# EasyEDA Pro project 一体板.epro, board PCB2_1
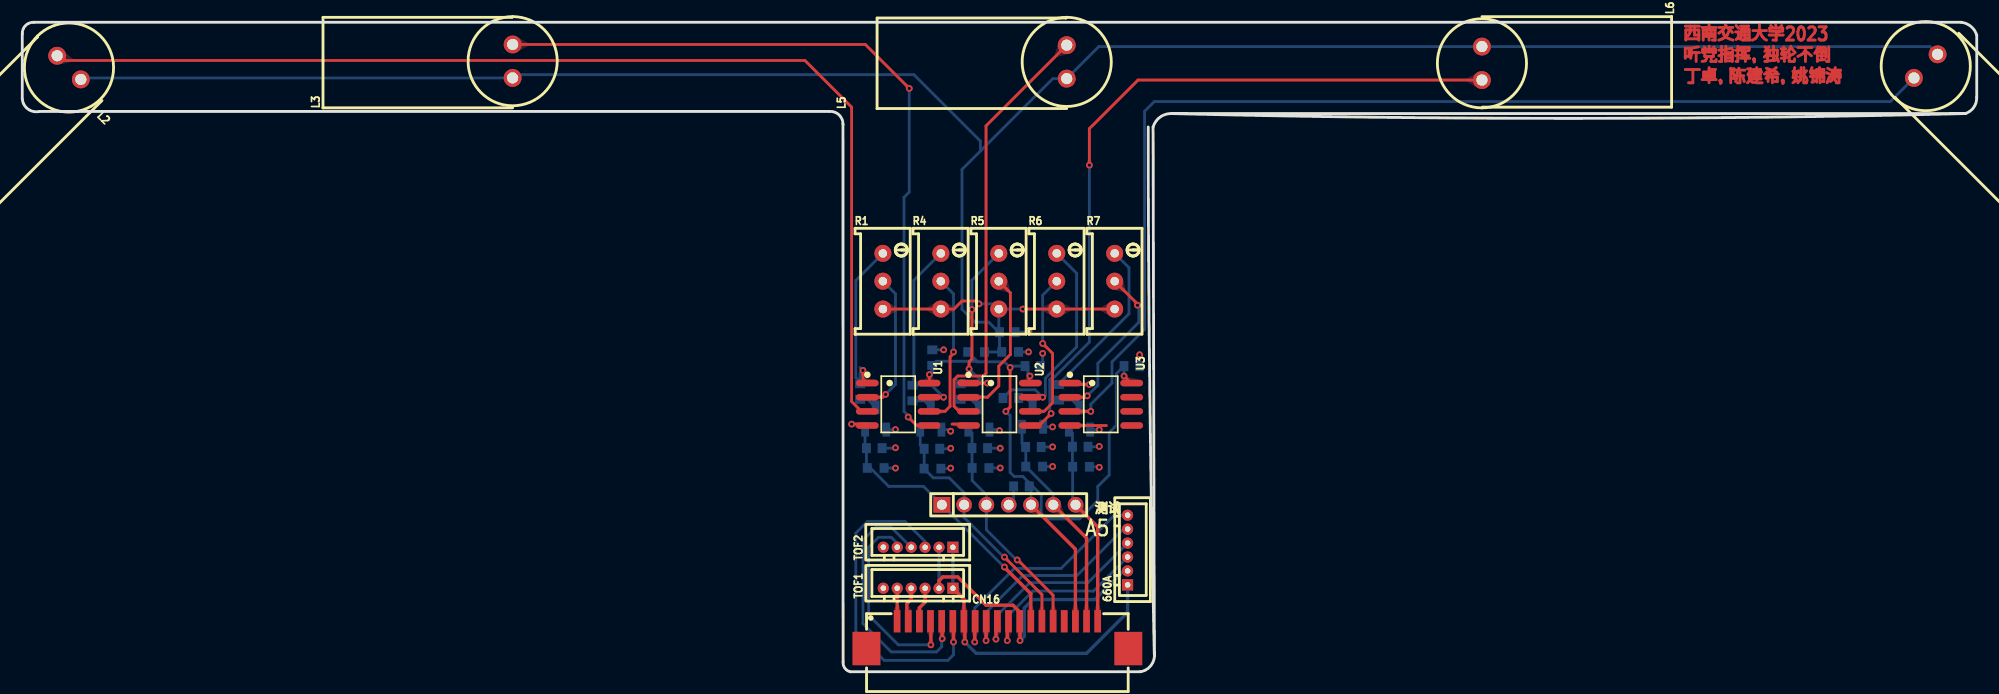
[diagram p9: board, top side]
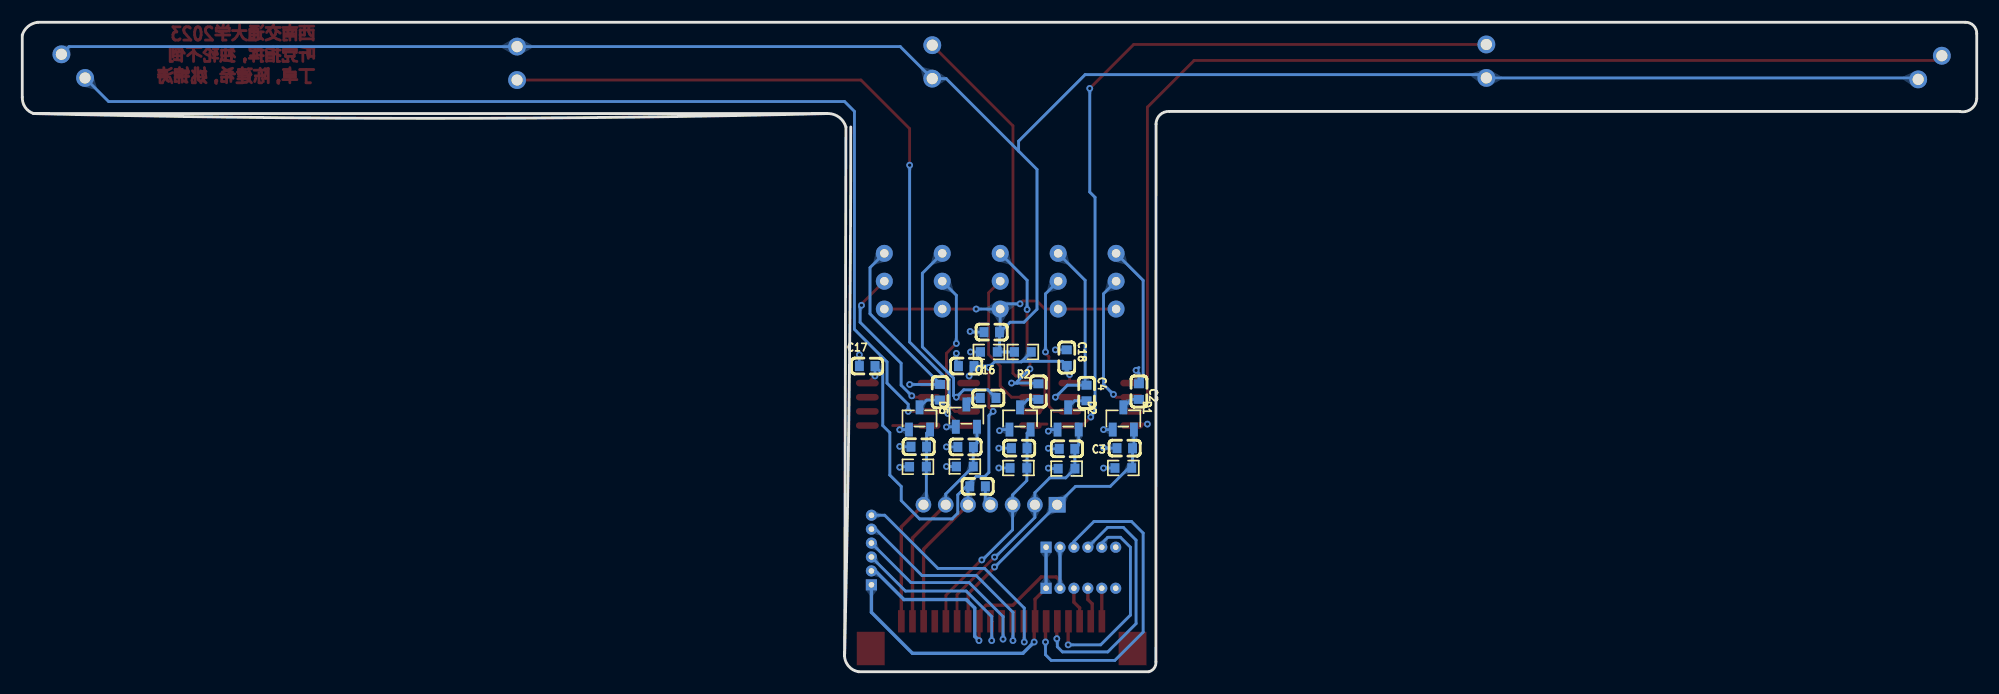
[diagram p10: board, bottom side, seen from below]

Outline 175.39 x 58.29 mm; copper layers: Top Layer, Bottom Layer. Coordinates in mm from the lower left corner of the outline.
Outline path: 101.48,48.89 101.59,1.65 arc(101.29,0.57) 100.33,0 74.3,0 arc(73.81,0.33) 73.66,0.89 73.65,49.15 arc(73.3,49.98) 72.45,50.29 1.52,50.29 arc(0.5,50.51) 0,51.44 0,57.28 arc(0.29,58) 1.02,58.29 173.99,58.29 arc(174.86,57.93) 175.39,57.15 175.39,51.56 arc(175.12,50.66) 174.37,50.1 ; 101.48,48.89 arc(102.05,49.74) 103,50.1 ; 101.48,48.89 arc(101.51,25.15) 101.6,1.4 ; 174.37,50.1 103.12,50.1 arc(138.75,50.08) 174.37,50.1
Stack: Top Layer 0.035mm / Dielectric1 1.51mm FR4 er 4.5 / Bottom Layer 0.035mm

## Design rules (mm)
template: JLCPCB Capability(Two Layers Board)
spacing copperThickness1oz (default): track to track 0.102, other pairs 0.152 to 0.3
spacing copperThickness2oz: track to track 0.203, other pairs 0.152 to 0.3
track width copperThickness1oz (default): min 0.127, default 0.254, max 2.54
track width copperThickness2oz: min 0.203, default 0.254, max 2.54
differential pair differentialPair (default): width min 0.127, default 0.254, max 2.54; gap min 0.152, default 0.152
via viaSize (default): diameter min 0.5, default 0.61, max 10; hole min 0.3, default 0.305, max 6.3

## Placement (name value [footprint] x y rotation side)
660A  -  [CONN-TH_6P-P1.25_HCTL_HC-1.25-6A]  99.19 10.92 90 top
C1  1uF  [C0603]  88.39 30.48 180 bottom
C2  100nF  [C0603]  75.18 25.15 270 bottom
C3  100nF  [C0603]  76.45 20.07 180 bottom
C4  100nF  [C0603]  79.88 25.02 270 bottom
C5  100nF  [C0603]  81.63 20.01 180 bottom
C6  100nF  [C0603]  84.2 25.15 270 bottom
C7  100nF  [C0603]  85.92 20.07 180 bottom
C8  100nF  [C0603]  88.71 24.57 0 bottom
C9  100nF  [C0603]  90.73 20.18 180 bottom
C10  100nF  [C0603]  93.03 25.08 270 bottom
C11  100nF  [C0603]  94.94 20.19 180 bottom
C13  1uF  [C0603]  89.66 16.64 0 bottom
C16  100nF  [C0603]  90.68 27.43 180 bottom
C17  100nF  [C0603]  99.57 27.43 180 bottom
C18  100nF  [C0603]  81.66 28.19 270 bottom
CN16  HC-1.25-6A  [CONN-TH_6P-P1.25_HCTL_HC-1.25-6A]  80.39 7.49 180 top
D1  BAT54S  [SOT-23-3_L2.9-W1.3-P1.90-LS2.4-BR]  76.58 22.73 270 bottom
D2  BAT54S  [SOT-23-3_L2.9-W1.3-P1.90-LS2.4-BR]  81.53 22.73 270 bottom
D3  BAT54S  [SOT-23-3_L2.9-W1.3-P1.90-LS2.4-BR]  85.85 22.73 270 bottom
D4  BAT54S  [SOT-23-3_L2.9-W1.3-P1.90-LS2.4-BR]  90.66 22.99 270 bottom
D5  BAT54S  [SOT-23-3_L2.9-W1.3-P1.90-LS2.4-BR]  94.87 22.73 270 bottom
H1  PZ200V-11-07P  [HDR-TH_7P-P2.00-V-M]  88.52 14.99 0 top
L2  10mH  [IND-TH_BD8.0-P3.00-D0.6]  4.19 54.23 135 top
L3  10mH  [IND-TH_BD8.0-P3.00-D0.6]  44 54.8 90 top
L5  10mH  [IND-TH_BD8.0-P3.00-D0.6]  93.73 54.74 90 top
L6  10mH  [IND-TH_BD8.0-P3.00-D0.6]  130.99 54.61 270 top
L7  10mH  [IND-TH_BD8.0-P3.00-D0.6]  170.82 54.36 225 top
R1  500kΩ  [RES-ADJ-TH_3P-L9.5-W4.85-P2.50-BL-BS]  77.23 35.05 0 top
R2  10kΩ  [R0603]  85.6 28.7 180 bottom
R3  10kΩ  [R0603]  88.65 28.7 180 bottom
R4  500kΩ  [RES-ADJ-TH_3P-L9.5-W4.85-P2.50-BL-BS]  82.43 35.05 0 top
R5  500kΩ  [RES-ADJ-TH_3P-L9.5-W4.85-P2.50-BL-BS]  87.63 35.05 0 top
R6  500kΩ  [RES-ADJ-TH_3P-L9.5-W4.85-P2.50-BL-BS]  92.83 35.05 0 top
R7  500kΩ  [RES-ADJ-TH_3P-L9.5-W4.85-P2.50-BL-BS]  98.03 35.05 0 top
R8  100kΩ  [R0603]  76.58 18.29 180 bottom
R9  100kΩ  [R0603]  81.67 18.23 180 bottom
R10  100kΩ  [R0603]  85.99 18.29 180 bottom
R11  100kΩ  [R0603]  90.81 18.41 180 bottom
R12  100kΩ  [R0603]  95.01 18.4 180 bottom
TOF1  X10B25L19T  [FPC-SMD_X10B25U19T]  87.5 3.3 0 top
TOF2  -  [CONN-TH_6P-P1.25_HCTL_HC-1.25-6A]  80.39 11.18 180 top
U1  OPA2350UA/2K5  [SOIC-8_L4.9-W3.9-P1.27-LS6.0-BL]  78.6 24 270 top
U2  OPA2350UA/2K5  [SOIC-8_L4.9-W3.9-P1.27-LS6.0-BL]  87.69 24 270 top
U3  OPA2350UA/2K5  [SOIC-8_L4.9-W3.9-P1.27-LS6.0-BL]  96.78 24 270 top

## Footprints (pads in the part's own frame, mm; a bottom-side part is the same pattern mirrored in y, then rotated)
C0603
  rect 0.8x0.9 smd: 1(-0.7,0) 2(0.7,0)
CONN-TH_6P-P1.25_HCTL_HC-1.25-6A
  rect 1x1 hole 0.5: 1(-3.125,0)
  round 1 hole 0.5: 2(-1.875,0) 3(-0.625,0) 4(0.625,0) 5(1.875,0) 6(3.125,0)
FPC-SMD_X10B25U19T
  rect 0.6x2 smd: 1(-9,1.225) 2(-8,1.225) 3(-7,1.225) 4(-6,1.225) 5(-5,1.225) 6(-4,1.225) 7(-3,1.225) 8(-2,1.225) 9(-1,1.225) 10(0,1.225) 11(1,1.225) 12(2,1.225) 13(3,1.225) 14(4,1.225) 15(5,1.225) 16(6,1.225) 17(7,1.225) 18(8,1.225) 19(9,1.225)
  rect 2.5x3 smd: 20(11.75,-1.225) 21(-11.75,-1.225)
HDR-TH_7P-P2.00-V-M
  rect 1.524x1.4 hole 0.9: 1(-6,0)
  round 1.4 hole 0.9: 2(-4,0) 3(-2,0) 4(0,0) 5(2,0) 6(4,0) 7(6,0)
IND-TH_BD8.0-P3.00-D0.6
  round 1.6 hole 1.001: 1(-1.501,0) 2(1.501,0)
R0603
  rect 0.806x0.864 smd: 1(-0.753,0) 2(0.753,0)
RES-ADJ-TH_3P-L9.5-W4.85-P2.50-BL-BS
  round 1.524 hole 0.762: 1(0,2.5) 2(0,0) 3(0,-2.5)
SOIC-8_L4.9-W3.9-P1.27-LS6.0-BL
  oval 0.588x2.045 smd: 1(-1.905,-2.772) 2(-0.635,-2.772) 3(0.635,-2.772) 4(1.905,-2.772) 5(1.905,2.772) 6(0.635,2.772) 7(-0.635,2.772) 8(-1.905,2.772)
SOT-23-3_L2.9-W1.3-P1.90-LS2.4-BR
  rect 1.25x0.7 smd: 1(1,-0.95) 2(1,0.95) 3(-1,0)

## Nets
2.5V: C1.2 L2.1 L3.1 L5.1 L6.1 L7.1 R1.3 R2.1 R3.2 R4.3 R5.3 R6.3 R7.3
3.3V_LDO: 660A.1 CN16.1 TOF1.7 TOF2.1
5V: C13.2 C16.2 C17.2 C18.2 H1.5 R2.2 TOF1.17 U1.8 U2.8 U3.8
GND: C1.1 C3.1 C5.1 C7.1 C9.1 C11.1 C13.1 C16.1 C17.1 C18.1 D1.1 D2.1 D3.1 D4.1 D5.1 H1.4 R3.1 R8.1 R9.1 R10.1 R11.1 R12.1 TOF1.16 TOF1.20 TOF1.21 U1.4 U2.4 U3.4
GND_OTHER: 660A.2 CN16.2 TOF1.12 TOF2.2
20.11: 660A.3 TOF1.11
20.12: 660A.5 TOF1.9
20.13: 660A.6 TOF1.8
20.14: 660A.4 TOF1.10
AD1: C3.2 D1.2 H1.1 R8.2 TOF1.13
AD2: C5.2 D2.2 H1.2 R9.2 TOF1.14
AD3: C7.2 D3.2 H1.3 R10.2 TOF1.15
AD4: C9.2 D4.2 H1.6 R11.2 TOF1.18
AD5: C11.2 D5.2 H1.7 R12.2 TOF1.19
DL1A_SCL: TOF1.6 TOF2.3
DL1A_SCL_2: CN16.3 TOF1.3
DL1A_SDA: TOF1.5 TOF2.4
DL1A_SDA_2: CN16.4 TOF1.2
DL1A_XSHUT: TOF1.4 TOF2.5
DL1A_XSHUT_2: CN16.5 TOF1.1
IN1+: L2.2 U1.3
IN1-: R1.2 U1.2
IN2+: L3.2 U1.5
IN2-: R4.2 U1.6
IN3+: L5.2 U2.3
IN3-: R5.2 U2.2
IN4+: L6.2 U2.5
IN4-: R6.2 U2.6
IN5+: L7.2 U3.3
IN5-: R7.2 U3.2
YFOUT1: C2.1 R1.1 U1.1
YFOUT2: C4.1 R4.1 U1.7
YFOUT3: C6.1 R5.1 U2.1
YFOUT4: C8.1 R6.1 U2.7
YFOUT5: C10.1 R7.1 U3.1
$1N1524: C2.2 D1.3
$1N1793: C4.2 D2.3
$1N1950: C6.2 D3.3
$1N2107: C8.2 D4.3
$1N2264: C10.2 D5.3

Pads without a net: CN16 6; TOF2 6; U3 5 6 7

## Via types
v1: diameter 0.61, hole 0.305, Top Layer to Bottom Layer, 57 vias

## Routing (per net, layer and track width the routed paths; a pad name or vN(x,y) marks a point on that pad's centre or on a via; arc(x,y) is an arc through that point)
2.5V: length 220.6
  Top Layer w0.254: R1.3 R4.3 83.61,32.55 84.33,33.27 85.6,33.27 v1(85.85,33.02) ; R7.3 R6.3 v1(89.79,32.55)
  Bottom Layer w0.254: R5.3 87.16,33.02 v1(85.85,33.02) ; R5.3 v1(89.79,32.55) ; R5.3 87.63,30.48 ; 87.63,30.48 C1.2 87.69,30.19 ; 87.63,30.48 86.74,31.37 85.49,31.37 84.33,32.53 84.33,45.09 85.98,46.74 ; 87.63,30.48 87.63,30.25 87.69,30.19 ; 87.69,30.19 87.69,28.9 R3.2 R2.1 ; 85.98,46.74 85.98,47.63 80.01,53.59 44.3,53.59 L3.1 5.38,53.3 L2.1 ; 85.98,46.74 92.48,53.24 L5.1 96.6,56.11 L6.1 171.18,56.11 L7.1
3.3V_LDO: length 28
  Top Layer w0.3: v1(84.58,2.67) 84.58,4.45 TOF1.7 84.5,6.51 CN16.1
  Bottom Layer w0.3: 660A.1 99.19,5.33 95.5,1.65 85.6,1.65 v1(84.58,2.67) ; TOF2.1 CN16.1
5V: length 63.5
  Top Layer w0.254: v1(90.42,26.54) 90.34,26.46 90.34,26.04 U2.8 ; v1(98.87,26.54) 99.5,25.91 U3.8 ; v1(88.27,23.37) 88.65,23.75 v1(88.65,27.31) ; U1.8 81.41,25.94 v1(81.41,26.67)
  Top Layer w0.3: TOF1.17 94.5,11 H1.5
  Bottom Layer w0.254: v1(90.42,26.54) 90.23,26.74 90.23,27.43 88.77,27.43 v1(88.65,27.31) 88.14,27.81 85.73,27.81 85.68,27.86 ; C18.2 82.03,27.86 85.68,27.86 ; H1.5 90.52,16.48 C13.2 ; C13.2 90.68,16.64 91.44,15.88 91.44,14.22 91.95,13.72 94.87,13.72 96.51,15.36 96.51,16.63 97.54,17.65 97.54,21.46 98.17,22.1 98.17,26.74 98.74,27.31 98.87,27.18 ; C13.2 90.36,16.95 89.79,17.53 89.01,17.53 88.65,17.89 88.65,22.99 v1(88.27,23.37) ; 98.87,27.18 v1(98.87,26.54) ; 98.87,27.18 C17.2 ; 85.68,27.86 R2.2
  Bottom Layer w0.381: v1(81.41,26.67) 81.66,26.92 C18.2
GND: length 27.5
  Top Layer w0.254: U2.4 84.79,22.23 83.44,22.23 ; v1(74.42,22.23) 75.7,22.23 75.83,22.1 ; U3.4 97.28,22.1
  Bottom Layer w0.254: v1(91.57,28.58) 91.57,27.5 91.63,27.43 ; v1(83.31,20.06) 83.26,20.01 C5.1 ; C7.1 v1(87.76,20.07) ; v1(96.65,18.35) 96.6,18.4 R12.1 ; v1(92.46,20.18) 92.45,20.18 C9.1 ; C3.1 78.32,20.07 v1(78.36,20.1) ; C11.1 96.62,20.19 v1(96.65,20.22) ; R9.1 83.27,18.23 v1(83.31,18.27) ; R3.1 v1(90.3,28.7) ; v1(83.31,21.59) 83.17,21.73 D2.1 ; v1(78.36,18.28) 78.35,18.29 R8.1 ; R11.1 92.45,18.42 v1(92.46,18.42) ; D5.1 96.63,21.73 v1(96.65,21.72) ; R10.1 v1(87.76,18.29) ; C18.1 82.55,28.89 ; D1.1 v1(78.36,21.73) ; v1(87.69,21.64) 87.6,21.73 D3.1 ; C1.1 90.17,30.48 ; D4.1 92.33,21.99 ; H1.4 88.96,15.43 C13.1 ; C17.1 v1(100.27,28.45)
  vias: v1(82.68,28.89) v1(90.33,30.55) v1(92.46,21.97)
GND_OTHER: length 29.4
  Top Layer w0.3: CN16.2 82.27,8.17 82.61,8.51 83.95,8.51 86.49,5.97 88.9,5.97 89.5,5.37 TOF1.12 89.54,4.5 v1(89.54,2.79)
  Bottom Layer w0.3: 660A.2 98.84,9.05 96.27,6.48 90.68,6.48 89.92,5.72 89.92,3.18 v1(89.53,2.79) ; TOF2.2 CN16.2
20.11: length 16.9
  Top Layer w0.3: v1(88.39,2.79) 88.39,4.42 TOF1.11
  Bottom Layer w0.254: 660A.3 96.13,7.24 90.68,7.24 88.39,4.95 v1(88.39,2.79)
20.12: length 20.1
  Top Layer w0.3: v1(86.49,2.79) 86.49,4.51 TOF1.9
  Bottom Layer w0.254: v1(86.49,2.79) 86.49,5.33 89.79,8.64 94.65,8.64 98.81,12.8 660A.5
20.13: length 22.1
  Top Layer w0.3: TOF1.8 85.47,4.5 v1(85.47,2.67)
  Bottom Layer w0.254: 660A.6 97.99,14.05 93.22,9.27 89.03,9.27 85.47,5.72 v1(85.47,2.67)
20.14: length 18.2
  Top Layer w0.3: TOF1.10 87.38,4.4 v1(87.38,2.92)
  Bottom Layer w0.254: v1(87.38,2.92) 87.38,4.95 90.42,8 95.64,8 660A.4
AD1: length 25.4
  Top Layer w0.3: v1(88.14,9.4) 88.14,9.37 90.5,7 TOF1.13
  Bottom Layer w0.254: v1(88.14,9.4) 88.11,9.4 H1.1 80.87,16.64 77.76,16.64 76.1,18.29 R8.2 75.75,18.36 C3.2 75.63,20.19 D1.2
AD2: length 22.6
  Top Layer w0.254: TOF1.14 91.5,6.92 v1(88.14,10.29)
  Bottom Layer w0.254: D2.2 80.58,20.36 C5.2 80.93,18.24 R9.2 81.75,17.4 83.18,17.4 84.52,16.07 H1.2 84.52,13.84 88.07,10.29 v1(88.14,10.29)
AD3: length 20.4
  Top Layer w0.254: 89.28,10.08 92.5,6.86 TOF1.15
  Bottom Layer w0.254: 84.9,21.73 85.22,21.41 C7.2 85.22,18.31 R10.2 85.24,17.15 86.52,15.88 H1.3 86.52,12.73 89.22,10.03 v1(89.28,10.03)
AD4: length 19.9
  Top Layer w0.3: TOF1.18 95.5,12 H1.6
  Bottom Layer w0.254: H1.6 92.52,15.95 R11.2 90.05,20.16 C9.2 89.71,20.5 D4.2
AD5: length 18.3
  Top Layer w0.3: H1.7 96.5,13 TOF1.19
  Bottom Layer w0.254: D5.2 94.24,21.41 C11.2 94.24,18.42 R12.2 94.26,15.25 H1.7
DL1A_SCL: length 29.8
  Top Layer w0.3: TOF1.6 83.57,4.46 v1(83.57,2.67)
  Bottom Layer w0.254: TOF2.3 81.02,11.68 79.22,13.48 75.84,13.48 74.8,12.45 74.8,3.56 77.34,1.02 83.06,1.02 83.57,1.52 v1(83.57,2.67)
DL1A_SCL_2: length 3.2
  Top Layer w0.3: CN16.3 81.02,6.24 80.5,5.73 TOF1.3
DL1A_SDA: length 23.7
  Top Layer w0.3: v1(82.55,2.96) 82.55,4.48 TOF1.5
  Bottom Layer w0.254: TOF2.4 77.99,12.95 76.58,12.95 75.44,11.81 75.44,4.32 77.98,1.78 82.04,1.78 82.5,2.24 82.5,2.92 v1(82.55,2.96)
DL1A_SDA_2: length 3.2
  Top Layer w0.3: TOF1.2 79.38,4.65 79.38,6.1 79.77,6.49 CN16.4
DL1A_XSHUT: length 18.4
  Top Layer w0.3: v1(81.53,2.41) 81.53,4.5 TOF1.4
  Bottom Layer w0.254: TOF2.5 78.52,11.53 77.98,12.07 76.83,12.07 75.95,11.18 75.95,5.08 78.61,2.41 v1(81.53,2.41)
DL1A_XSHUT_2: length 3
  Top Layer w0.3: CN16.5 78.52,4.54 TOF1.1
IN1+: length 101.4
  Top Layer w0.254: 75.83,23.37 75.31,23.37 74.42,24.26 74.42,50.67 70.23,54.86 3.56,54.86 L2.2
IN1-: length 12.7
  Top Layer w0.254: v1(77.47,24.89) 77.22,24.64 75.83,24.64
  Bottom Layer w0.254: v1(77.47,24.89) 78.36,25.78 78.36,33.92 R1.2
IN2+: length 69.3
  Top Layer w0.254: v1(79.59,52.36) 75.65,56.3 L3.2 ; U1.5 80.26,22.1 v1(79.5,22.86)
  Bottom Layer w0.254: v1(79.59,52.36) 79.59,43.05 79.12,42.58 79.12,23.37 79.5,22.99 v1(79.5,22.86)
IN2-: length 14.1
  Top Layer w0.254: 83.57,28.58 83.26,28.27 83.26,23.83 82.8,23.37 U1.6 ; 83.57,28.58 v1(83.57,28.7) ; 83.57,28.58 83.69,28.7
  Bottom Layer w0.254: R4.2 83.57,33.92 v1(83.57,28.7)
IN3+: length 39.4
  Top Layer w0.254: L5.2 86.49,49 86.49,26.8 86.23,26.54 83.95,26.54 83.62,26.21 83.62,23.83 84.07,23.37 U2.3
IN3-: length 13.4
  Top Layer w0.254: R5.2 88.67,34.01 88.67,28.47 87.63,27.43 87.63,25.65 86.61,24.64 U2.2
IN4+: length 66.5
  Top Layer w0.254: v1(92.33,23.18) 91.25,22.1 U2.5 ; v1(95.76,45.47) 95.76,48.74 100.12,53.11 L6.2
  Bottom Layer w0.254: v1(95.76,45.47) 95.76,29.59 92.63,26.46 92.46,26.46 92.2,26.21 92.2,23.31 v1(92.33,23.18)
IN4-: length 14.1
  Top Layer w0.254: v1(91.57,29.46) 92.46,28.58 92.46,24.13 91.69,23.37 U2.6
  Bottom Layer w0.254: R6.2 91.57,33.79 v1(91.57,29.46)
IN5+: length 101.1
  Top Layer w0.254: v1(95.89,23.37) U3.3
  Bottom Layer w0.254: v1(95.88,23.37) 95.88,24 97.79,25.91 97.79,27.81 100.71,30.73 100.71,50.29 101.6,51.18 167.64,51.18 L7.2
IN5-: length 15.1
  Top Layer w0.254: v1(95.57,24.76) 95.44,24.64 U3.2 ; R7.2 100.08,33.01 v1(100.08,32.89)
  Bottom Layer w0.254: 100.2,32.77 100.23,32.74 ; 100.2,32.77 100.2,32.89 ; 100.2,32.77 100.2,31.37 96.52,27.69 96.52,25.72 95.44,24.64 ; 100.2,32.77 v1(100.08,32.89)
YFOUT1: length 15.7
  Top Layer w0.254: v1(75.44,27.05) 75.44,26.3 75.83,25.91
  Bottom Layer w0.254: 75.18,26.04 74.8,26.42 74.8,35.13 R1.1 ; 75.18,26.04 C2.1 ; 75.18,26.04 75.18,26.8 v1(75.44,27.05) 75.18,27.31
YFOUT2: length 17.4
  Top Layer w0.254: v1(82.68,24.64) U1.7
  Bottom Layer w0.254: v1(82.68,24.64) 81.6,25.72 C4.1 80.01,25.85 80.01,35.13 R4.1
YFOUT3: length 17.4
  Top Layer w0.254: v1(86.61,25.91) U2.1 ; v1(84.96,27.18) 84.96,27.81 85.22,28.07 v1(85.22,32.51)
  Bottom Layer w0.254: 86.11,25.91 84.26,25.91 C6.1 ; 86.11,25.91 86.11,26.04 v1(84.96,27.18) ; 86.11,25.91 v1(86.61,25.91) ; v1(85.22,32.51) 85.22,35.14 R5.1
YFOUT4: length 20.1
  Top Layer w0.254: v1(91.57,24.64) U2.7
  Bottom Layer w0.254: C8.1 88.74,25.3 90.9,25.3 91.43,24.77 91.81,24.77 91.81,26.35 94.62,29.15 94.62,35.77 R6.1
YFOUT5: length 19.4
  Top Layer w0.254: U3.1 94.14,25.78 v1(95.76,25.78)
  Bottom Layer w0.254: R7.1 99.31,36.27 99.31,32.13 93.03,25.84 C10.1 95.76,25.78 v1(95.76,25.78)
$1N1524: length 1.7
  Bottom Layer w0.254: D1.3 75.87,24.45 C2.2
$1N1793: length 1.9
  Bottom Layer w0.254: C4.2 80.95,24.32 D2.3
$1N1950: length 1.9
  Bottom Layer w0.254: D3.3 85.14,24.45 C6.2
$1N2107: length 1.5
  Bottom Layer w0.254: C8.2 90.08,24.57 D4.3
$1N2264: length 2.1
  Bottom Layer w0.254: C10.2 94.22,24.38 D5.3

## Copper pours and planes (outline as drawn; the poured copper is in the pictures)
GND on Top Layer: 71.25,31.62 99.82,31.62 103.38,28.07 103.38,0.38 71.25,0.38

Small or netless copper shapes (teardrops, artwork), in the pictures only: 96 on Top Layer, 175 on Bottom Layer

## Text on the board
Top Layer: 西南交通大学2023 / 听党指挥，独轮不倒 / 丁卓，陈建希，姚锦涛
Top Solder Mask Layer: 西南交通大学2023 / 听党指挥，独轮不倒 / 丁卓，陈建希，姚锦涛
Top Silkscreen Layer: A5 | 测试
